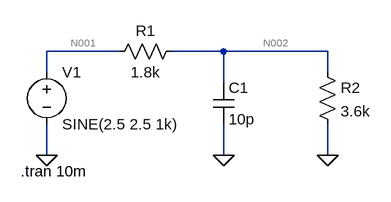
[diagram p0: schematic filtr_RC.asc]
filtr_RC.asc, the LTspice schematic file:
Version 4.1
SHEET 1 880 680
WIRE 208 112 96 112
WIRE 368 112 288 112
WIRE 528 112 368 112
WIRE 96 144 96 112
WIRE 528 144 528 112
WIRE 368 160 368 112
WIRE 96 272 96 224
WIRE 368 272 368 224
WIRE 528 272 528 224
FLAG 96 272 0
FLAG 368 272 0
FLAG 528 272 0
SYMBOL voltage 96 128 R0
WINDOW 123 0 0 Left 0
WINDOW 39 0 0 Left 0
SYMATTR InstName V1
SYMATTR Value SINE(2.5 2.5 1k)
SYMBOL res 304 96 R90
WINDOW 0 0 56 VBottom 2
WINDOW 3 32 56 VTop 2
SYMATTR InstName R1
SYMATTR Value 1.8k
SYMBOL cap 352 160 R0
SYMATTR InstName C1
SYMATTR Value 10p
SYMBOL res 512 128 R0
SYMATTR InstName R2
SYMATTR Value 3.6k
TEXT 56 296 Left 2 !.tran 10m

The netlist it stands for:
* filtr_RC.asc
V1 N001 0 SINE(2.5 2.5 1k)
R1 N002 N001 1.8k
C1 N002 0 10p
R2 N002 0 3.6k
.tran 10m
.backanno
.end

* Results of the author's LTspice run, read from the files saved beside the schematic
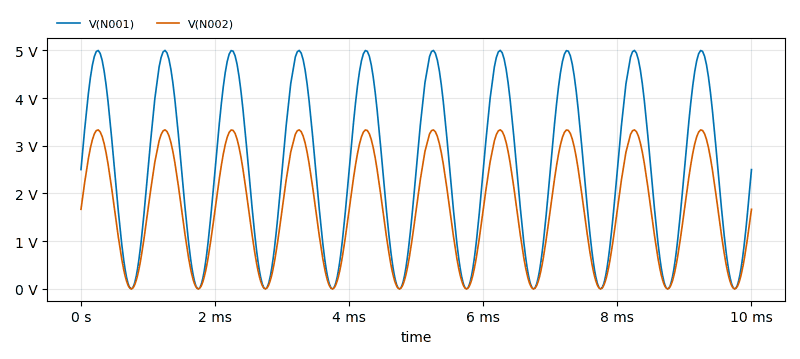
[diagram p1: Transient Analysis of filtr_RC.asc, plotted from the saved traces]
* Transient Analysis, 1 run:
*   V(N001): min 37.51 µV, max 5 V, average 2.497 V, rms 3.062 V, last 2.5 V
*   V(N002): min 25.71 µV, max 3.333 V, average 1.664 V, rms 2.042 V, last 1.667 V